# Altium project iot-sensor.PrjPCB
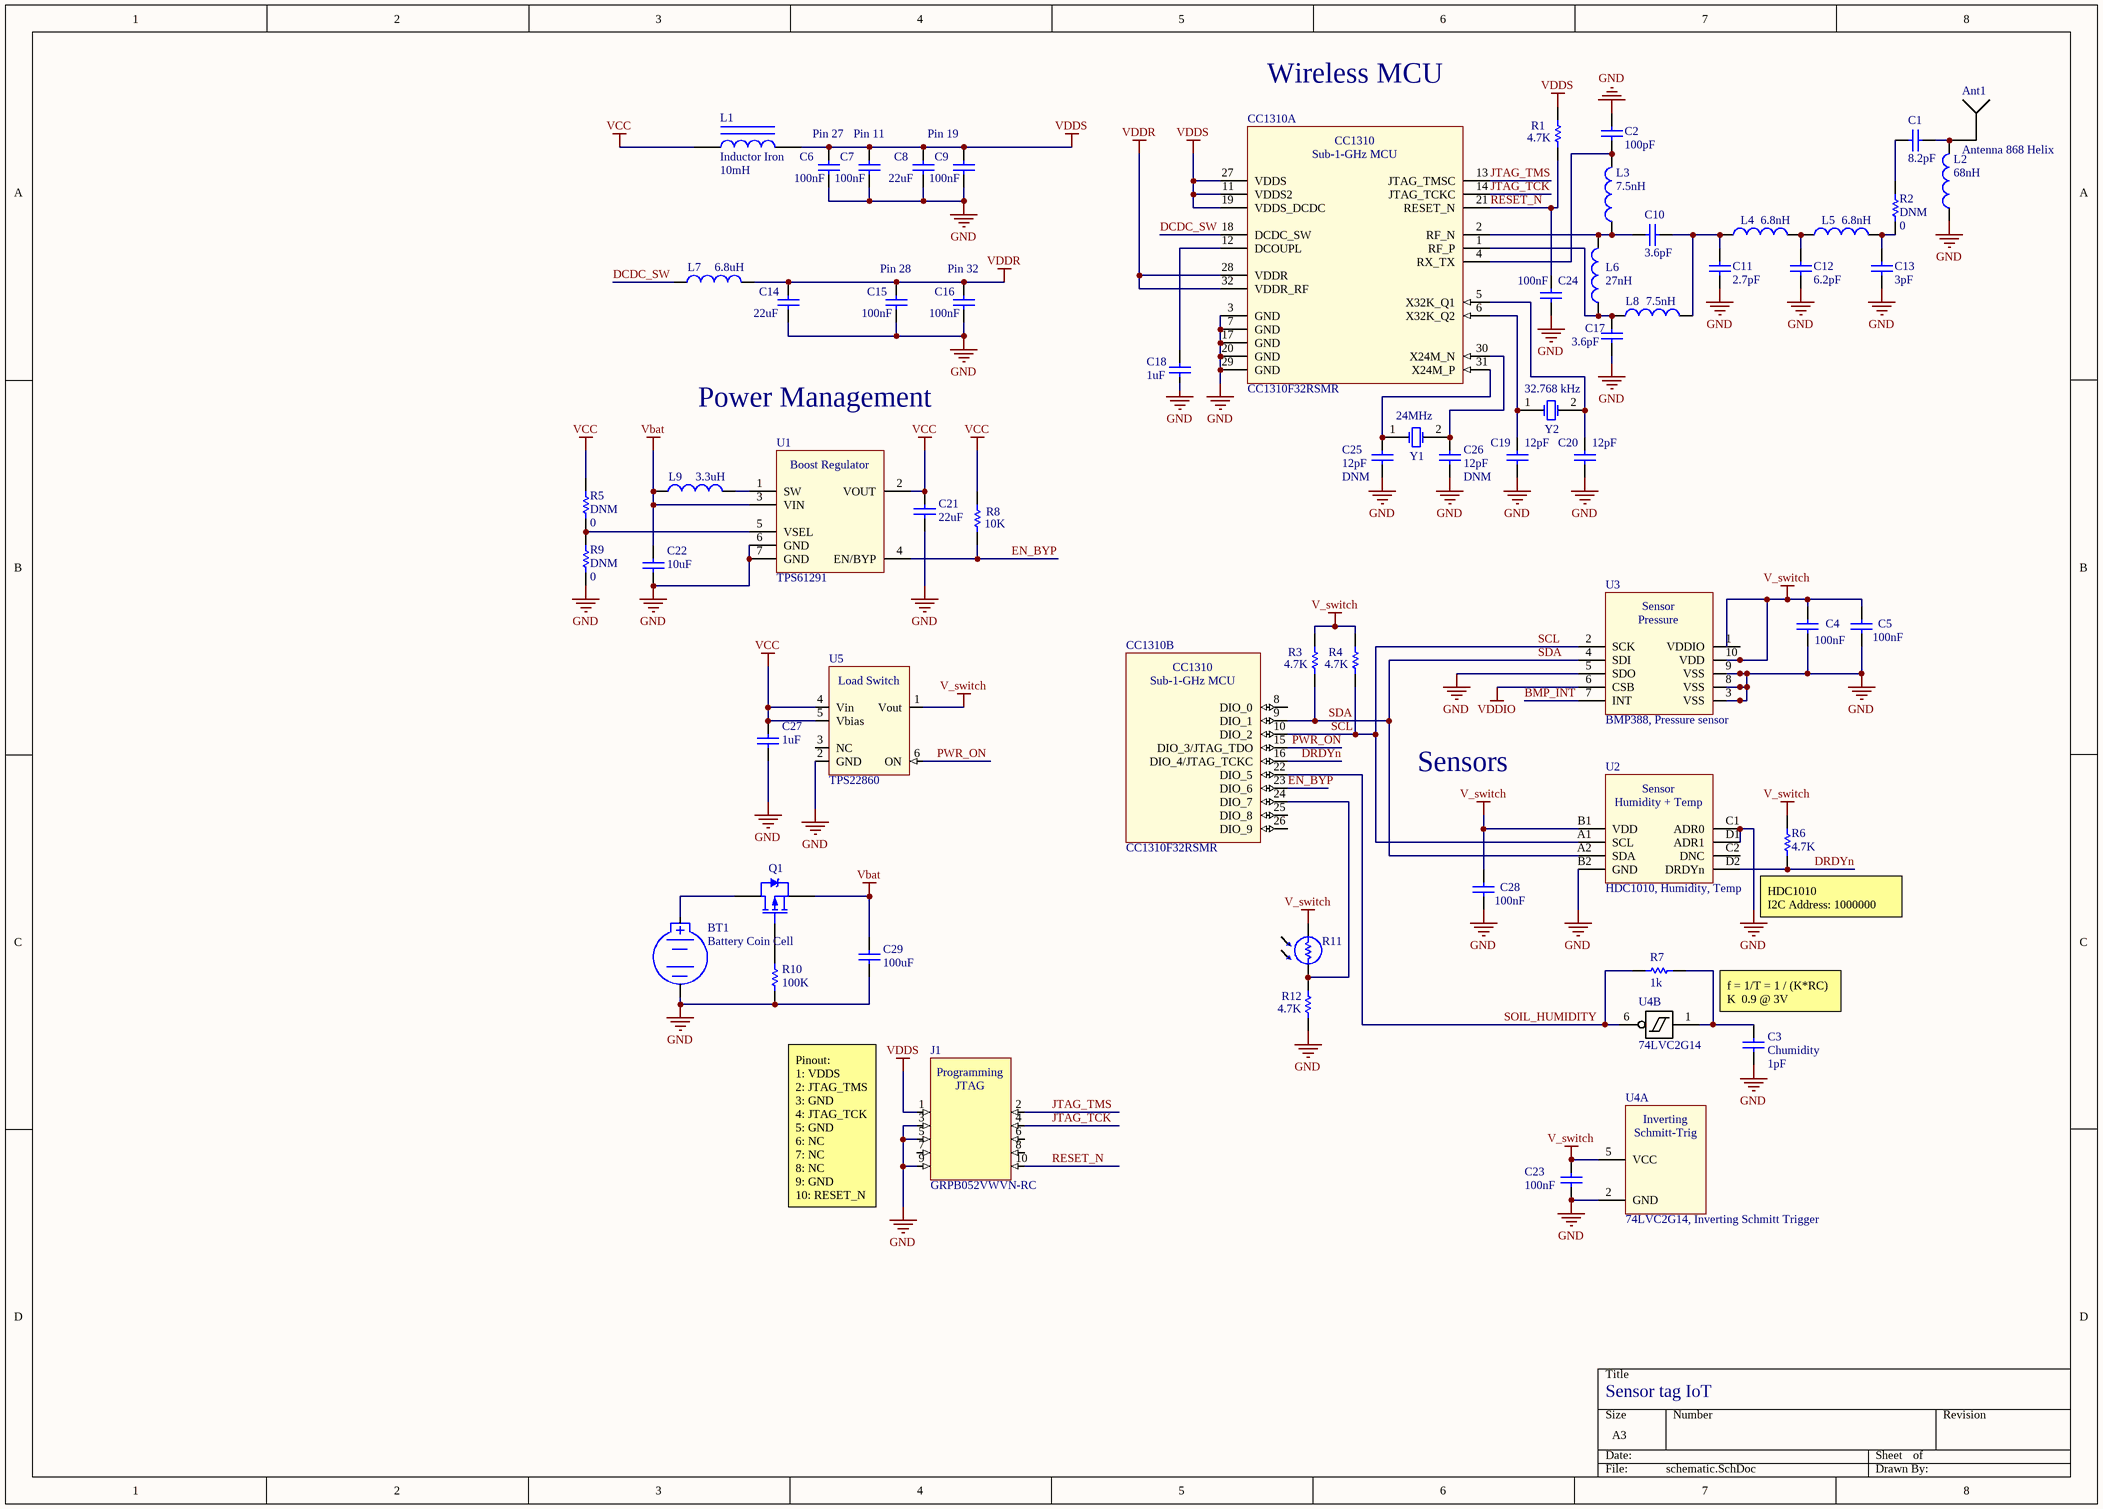
[diagram p0: schematic.SchDoc]
1 sheet, 62 parts. Net scope: global (net labels, ports and power ports of the same name join across sheets).
Board file: pcb.PcbDoc

## Sheet schematic.SchDoc
size A3

### Parts
Ant1  Antenna 868 Helix  [Antenna_868_Helix]
BT1  Battery Coin Cell  [SMTU2032-LF]
C1  value 8.2pF  [0402 (CAP)]  (hidden comment: Cap)
C2  value 100pF  [0402 (CAP)]  (hidden comment: Cap)
C3  Chumidity  value 1pF  [0402 (CAP)]
C4  value 100nF  [0402 (CAP)]  (hidden comment: Cap)
C5  value 100nF  [0402 (CAP)]  (hidden comment: Cap)
C6  value 100nF  [0402 (CAP)]  (hidden comment: Cap)
C7  value 100nF  [0402 (CAP)]  (hidden comment: Cap)
C8  value 22uF  [0402 (CAP)]  (hidden comment: Cap)
C9  value 100nF  [0402 (CAP)]  (hidden comment: Cap)
C10  value 3.6pF  [0402 (CAP)]  (hidden comment: Cap)
C11  value 2.7pF  [0402 (CAP)]  (hidden comment: Cap)
C12  value 6.2pF  [0402 (CAP)]  (hidden comment: Cap)
C13  value 3pF  [0402 (CAP)]  (hidden comment: Cap)
C14  value 22uF  [0402 (CAP)]  (hidden comment: Cap)
C15  value 100nF  [0402 (CAP)]  (hidden comment: Cap)
C16  value 100nF  [0402 (CAP)]  (hidden comment: Cap)
C17  value 3.6pF  [0402 (CAP)]  (hidden comment: Cap)
C18  value 1uF  [0402 (CAP)]  (hidden comment: Cap)
C19  value 12pF  [0402 (CAP)]  (hidden comment: Cap)
C20  value 12pF  [0402 (CAP)]  (hidden comment: Cap)
C21  value 22uF  [0402 (CAP)]  (hidden comment: Cap)
C22  value 10uF  [0402 (CAP)]  (hidden comment: Cap)
C23  value 100nF  [0402 (CAP)]  (hidden comment: Cap)
C24  value 100nF  [0402 (CAP)]  (hidden comment: Cap)
C25  DNM  value 12pF  [0402 (CAP)]
C26  DNM  value 12pF  [0402 (CAP)]
C27  value 1uF  [0402 (CAP)]  (hidden comment: Cap)
C28  value 100nF  [0402 (CAP)]  (hidden comment: Cap)
C29  value 100uF  [0402 (CAP)]  (hidden comment: Cap)
CC1310  CC1310F32RSMR  [CC1310F32RSMR]  (parts A,B of 2)
J1  GRPB052VWVN-RC
L1  Inductor Iron  value 10mH  [0603 (IND)]
L2  value 68nH  [0603 (IND)]  (hidden comment: Inductor)
L3  value 7.5nH  [0603 (IND)]  (hidden comment: Inductor)
L4  value 6.8nH  [0603 (IND)]  (hidden comment: Inductor)
L5  value 6.8nH  [0603 (IND)]  (hidden comment: Inductor)
L6  value 27nH  [0603 (IND)]  (hidden comment: Inductor)
L7  value 6.8uH  [0603 (IND)]  (hidden comment: Inductor)
L8  value 7.5nH  [0603 (IND)]  (hidden comment: Inductor)
L9  value 3.3uH  [0603 (IND)]  (hidden comment: Inductor)
Q1  PMOS-2  [TO-220AB]  (value not drawn)
R1  value 4.7K  [0402 (RES)]  (hidden comment: Res1)
R2  DNM  value 0  [0402 (RES)]
R3  value 4.7K  [0402 (RES)]  (hidden comment: Res1)
R4  value 4.7K  [0402 (RES)]  (hidden comment: Res1)
R5  DNM  value 0  [0402 (RES)]
R6  value 4.7K  [0402 (RES)]  (hidden comment: Res1)
R7  value 1k  [0402 (RES)]  (hidden comment: Rcharge)
R8  value 10K  [0402 (RES)]  (hidden comment: Res1)
R9  DNM  value 0  [0402 (RES)]
R10  value 100K  [0402 (RES)]  (hidden comment: Res1)
R11  Photo Resistor  (value not drawn)
R12  value 4.7K  [0402 (RES)]  (hidden comment: Res1)
U1  TPS61291  [TPS61291]
U2  HDC1010, Humidity, Temp  [HDC1010]
U3  BMP388, Pressure sensor  [BMP388]
U4  74LVC2G14, Inverting Schmitt Trigger  [74LVC2G14]  (parts A,B of 3)
U5  TPS22860  [SOT23-5]
Y1  24MHz  [R38]
Y2  32.768 kHz  [R38]

### Nets
GND: BT1.2(Negative) C2.1 C3.1 C4.1 C5.1 C6.1 C7.1 C8.1 C9.1 C11.2 C12.2 C13.2 C14.1 C15.1 C16.1 C17.2 C18.1 C19.1 C20.1 C21.1 C22.1 C23.1 C24.2 C25.1 C26.1 C27.1 C28.1 C29.1 CC1310.3(GND) CC1310.7(GND) CC1310.17(GND) CC1310.20(GND) CC1310.29(GND) J1.3(GND) J1.5(GND) J1.9(GND) L2.2 R9.2 R10.2 R12.1 U1.6(GND) U1.7(GND) U2.B2(GND) U2.C1(ADR0) U2.D1(ADR1) U3.3(VSS) U3.5(SDO) U3.8(VSS) U3.9(VSS) U4.2(GND) U5.2(GND)
V_switch: C4.2 C5.2 C23.2 C28.2 R3.2 R4.2 R6.1 R11.1 U2.B1(VDD) U3.10(VDD) U4.5(VCC) U5.1(Vout)
Vbat: C22.2 C29.2 L9.1 Q1.3(S) U1.3(VIN)
VCC: C21.2 C27.2 L1.1 R5.1 R8.1 U1.2(VOUT) U5.4(Vin) U5.5(Vbias)
VDDIO: U3.6(CSB)
VDDR: C14.2 C15.2 C16.2 CC1310.28(VDDR) CC1310.32(VDDR_RF) L7.2
VDDS: C6.2 C7.2 C8.2 C9.2 CC1310.11(VDDS2) CC1310.19(VDDS_DCDC) CC1310.27(VDDS) J1.1(VDDS) L1.2 R1.2
BMP_INT: U3.7(INT)
DCDC_SW: CC1310.18(DCDC_SW) L7.1
DRDYn: CC1310.16(DIO_4/JTAG_TCKC) R6.2 U2.D2(DRDYn)
EN_BYP: CC1310.23(DIO_6) R8.2 U1.4(EN/BYP)
JTAG_TCK: CC1310.14(JTAG_TCKC) J1.4(JTAG_TCK)
JTAG_TMS: CC1310.13(JTAG_TMSC) J1.2(JTAG_TMS)
PWR_ON: CC1310.15(DIO_3/JTAG_TDO) U5.6(ON)
RESET_N: C24.1 CC1310.21(RESET_N) J1.10(RESET_N) R1.1
SCL: CC1310.10(DIO_2) R4.1 U2.A1(SCL) U3.2(SCK)
SDA: CC1310.9(DIO_1) R3.1 U2.A2(SDA) U3.4(SDI)
SOIL_HUMIDITY: CC1310.22(DIO_5) R7.2 U4.6(1Y)
NetAnt1_0: Ant1.0 C1.2 L2.1
NetBT1_1: BT1.1(Positive) Q1.2(D)
NetC1_1: C1.1 R2.1
NetC2_2: C2.2 CC1310.4(RX_TX) L3.2
NetC3_2: C3.2 R7.1 U4.1(1A)
NetC10_1: C10.1 CC1310.2(RF_N) L3.1 L6.1
NetC10_2: C10.2 C11.1 L4.2 L8.1
NetC12_1: C12.1 L4.1 L5.2
NetC13_1: C13.1 L5.1 R2.2
NetC17_1: C17.1 CC1310.1(RF_P) L6.2 L8.2
NetC18_2: C18.2 CC1310.12(DCOUPL)
NetC19_2: C19.2 CC1310.6(X32K_Q2) Y2.1(OSC1)
NetC20_2: C20.2 CC1310.5(X32K_Q1) Y2.2(OSC2)
NetC25_2: C25.2 CC1310.31(X24M_P) Y1.1(OSC1)
NetC26_2: C26.2 CC1310.30(X24M_N) Y1.2(OSC2)
NetCC1310_24: CC1310.24(DIO_7) R11.2 R12.2
NetL9_2: L9.2 U1.1(SW)
NetQ1_1: Q1.1(G) R10.1
NetR5_2: R5.2 R9.1 U1.5(VSEL)

Not connected (* = marked no-connect by the designer): CC1310 8(DIO_0) 25(DIO_8) 26(DIO_9); J1 6(NC) 7(NC) 8(NC); U2 C2(DNC); U3 1(VDDIO); U5 3(NC)

### Notes on the sheet
- Wireless MCU
- Pin 27
- Pin 11
- Pin 19
- (near C15) Pin 28
- (near C16) Pin 32
- Power Management
- Sensors
- (near R6) HDC1010
  I2C Address: 1000000
- (near C3) f = 1/T = 1 / (K*RC)
  K  0.9 @ 3V
- Pinout:
  1: VDDS
  2: JTAG_TMS
  3: GND
  4: JTAG_TCK
  5: GND
  6: NC
  7: NC
  8: NC
  9: GND
  10: RESET_N
- Sensor tag IoT
- (in symbol 74LVC2G14, part A) Inverting; Schmitt-Trig
- (in symbol BMP388) Sensor; Pressure
- (in symbol GRPB052VWVN-RC) Programming; JTAG
- (in symbol HDC1010) Sensor; Humidity + Temp
- (in symbol TPS22860) Load Switch
- (in symbol TPS61291) Boost Regulator
- (in symbol Crystal) GND

### Library data of the parts
C1-C29 = Cap: Capacitor; Published: 8-Jun-2000; LatestRevisionDate: 17-Jul-2002; LatestRevisionNote: Re-released for DXP Platform.; PackageReference: RAD-0.3; Publisher: Altium Limited; PackageDescription: Radial Cap, Thru-Hole; 2 Leads; 0.3 in Pin Spacing
L1 = Inductor Iron: Magnetic-Core Inductor; Published: 24-Mar-1999; LatestRevisionDate: 17-Jul-2002; LatestRevisionNote: Re-released for DXP Platform.; PackageReference: AXIAL-0.9; Publisher: Altium Limited; PackageDescription: Axial Device, Thru-Hole; 2 Leads; 0.9 in Pin Spacing
L2-L9 = Inductor: Code_IEC: 1005; Published: 8-Jun-2000; LatestRevisionDate: 29-May-2009; LatestRevisionNote: IPC-7351 Footprint Added.; PackageReference: 0402-A; Publisher: Altium Limited; PackageDescription: Chip Inductor; Code_JEITA: 0402
Q1 = PMOS-2: P-Channel Power MOSFET; Note: Pin 4 not drawn and electrically connected to Pin 2.; Published: 8-Jun-2000; LatestRevisionDate: 17-Jul-2002; LatestRevisionNote: Re-released for DXP Platform.; DatasheetVersion: PD-9.390D; PackageVersion: Feb-1997; PackageReference: TO-220AB; Publisher: Altium Limited; PackageDescription: TO, Thru-Hole, Vertical, Heatsink Mounted; 3 In-Line Leads; Pitch 2.54 mm; ComponentLink1Description: Manufacturer Link; ComponentLink1URL: http://www.irf.com/
R1-R10 R12 = Res1: Resistor; Published: 8-Jun-2000; LatestRevisionDate: 17-Jul-2002; LatestRevisionNote: Re-released for DXP Platform.; PackageReference: AXIAL-0.3; Publisher: Altium Limited; PackageDescription: Axial Device, Thru-Hole; 2 Leads; 0.3 in Pin Spacing
U2 = HDC1010
U3 = BMP388
U4 = 74LVC2G14
Y1 Y2 = XTAL: Crystal Oscillator; Published: 8-Jun-2000; LatestRevisionDate: 17-Jul-2002; LatestRevisionNote: Re-released for DXP Platform.; PackageReference: R38; Publisher: Altium Limited; PackageDescription: Crystal, Thru-Hole; 2 Leads; Body 3.1 x 8.2 mm (Dia.xH)